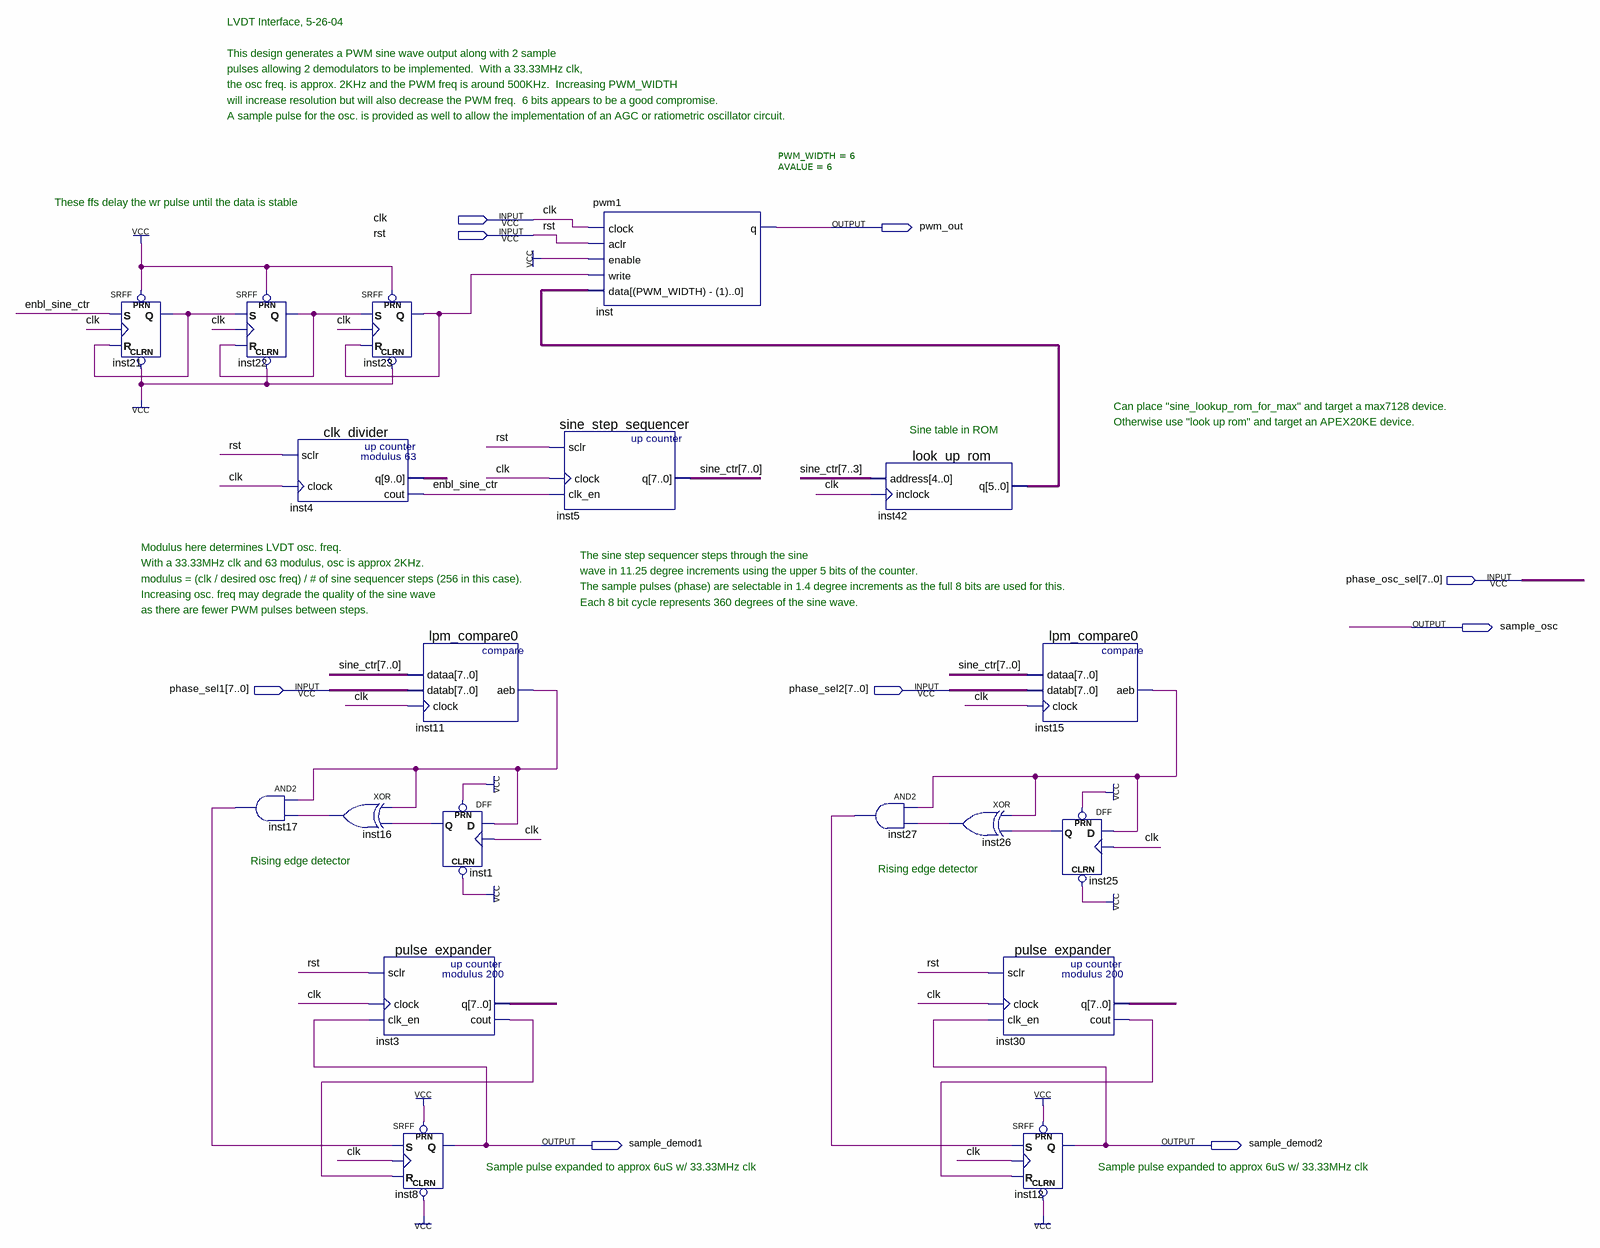
[diagram p0: schematic sheet]
// Quartus schematic lvdt_interface_wo_osc_demod.bdf as structural Verilog: 19 symbols, 9 pins
module lvdt_interface_wo_osc_demod (
  input  clk,
  input  rst,
  input  [7:0] phase_osc_sel,
  input  [7:0] phase_sel1,
  input  [7:0] phase_sel2,
  output pwm_out,
  output sample_osc,
  output sample_demod1,
  output sample_demod2
);

  wire enbl_sine_ctr, inst1_q, inst3_cout, inst11_aeb, inst15_aeb, inst16_out, inst17_out, inst21_q,
       inst22_q, inst23_q, inst25_q, inst26_out, inst27_out, inst30_cout;
  wire [5:0] inst42_q;
  wire [7:0] inst3_q, inst30_q, sine_ctr;
  wire [9:0] inst4_q;

  SRFF inst21 (.PRN(1'b1), .CLRN(1'b1), .S(enbl_sine_ctr), .R(inst21_q), .CLK(clk), .Q(inst21_q));
  SRFF inst22 (.PRN(1'b1), .CLRN(1'b1), .S(inst21_q), .R(inst22_q), .CLK(clk), .Q(inst22_q));
  and inst17 (inst17_out, inst11_aeb, inst16_out);
  clk_divider inst4 (.sclr(rst), .clock(clk), .q(inst4_q), .cout(enbl_sine_ctr));
  SRFF inst23 (.PRN(1'b1), .CLRN(1'b1), .S(inst22_q), .R(inst23_q), .CLK(clk), .Q(inst23_q));
  xor inst16 (inst16_out, inst11_aeb, inst1_q);
  lpm_compare0 inst11 (.dataa(sine_ctr), .datab(phase_sel1), .clock(clk), .aeb(inst11_aeb));
  pulse_expander inst3 (.sclr(rst), .clock(clk), .clk_en(sample_demod1), .q(inst3_q), .cout(inst3_cout));
  SRFF inst8 (.PRN(1'b1), .CLRN(1'b1), .S(inst17_out), .R(inst3_cout), .CLK(clk), .Q(sample_demod1));
  DFF inst1 (.CLRN(1'b1), .CLK(clk), .D(inst11_aeb), .PRN(1'b1), .Q(inst1_q));
  sine_step_sequencer inst5 (.sclr(rst), .clock(clk), .clk_en(enbl_sine_ctr), .q(sine_ctr));
  pwm1 #(.PWM_WIDTH(6), .AVALUE(6)) inst (
    .clock(clk), .aclr(rst), .enable(1'b1), .write(inst23_q), .data(inst42_q), .q(pwm_out));
  and inst27 (inst27_out, inst15_aeb, inst26_out);
  look_up_rom inst42 (.address(sine_ctr[7:3]), .inclock(clk), .q(inst42_q));
  xor inst26 (inst26_out, inst15_aeb, inst25_q);
  pulse_expander inst30 (.sclr(rst), .clock(clk), .clk_en(sample_demod2), .q(inst30_q), .cout(inst30_cout));
  lpm_compare0 inst15 (.dataa(sine_ctr), .datab(phase_sel2), .clock(clk), .aeb(inst15_aeb));
  DFF inst25 (.CLRN(1'b1), .CLK(clk), .D(inst15_aeb), .PRN(1'b1), .Q(inst25_q));
  SRFF inst12 (.PRN(1'b1), .CLRN(1'b1), .S(inst27_out), .R(inst30_cout), .CLK(clk), .Q(sample_demod2));

  // Notes on the sheet:
  //   LVDT Interface, 5-26-04
  //   This design generates a PWM sine wave output along with 2 sample
  //   pulses allowing 2 demodulators to be implemented.  With a 33.33MHz clk,
  //   the osc freq. is approx. 2KHz and the PWM freq is around 500KHz.  Increasing PWM_WIDTH
  //   will increase resolution but will also decrease the PWM freq.  6 bits appears to be a good compromise.
  //   A sample pulse for the osc. is provided as well to allow the implementation of an AGC or ratiometric oscillator circuit.
  //   These ffs delay the wr pulse until the data is stable
  //   Can place "sine_lookup_rom_for_max" and target a max7128 device.
  //   Otherwise use "look up rom" and target an APEX20KE device.
  //   Sine table in ROM
  //   Modulus here determines LVDT osc. freq.
  //   The sine step sequencer steps through the sine
  //   With a 33.33MHz clk and 63 modulus, osc is approx 2KHz.
  //   wave in 11.25 degree increments using the upper 5 bits of the counter.
  //   modulus = (clk / desired osc freq) / # of sine sequencer steps (256 in this case).
  //   The sample pulses (phase) are selectable in 1.4 degree increments as the full 8 bits are used for this.
  //   Increasing osc. freq may degrade the quality of the sine wave
  //   Each 8 bit cycle represents 360 degrees of the sine wave.
  //   as there are fewer PWM pulses between steps.
  //   Rising edge detector
  //   Rising edge detector
  //   Sample pulse expanded to approx 6uS w/ 33.33MHz clk
  //   Sample pulse expanded to approx 6uS w/ 33.33MHz clk
endmodule
